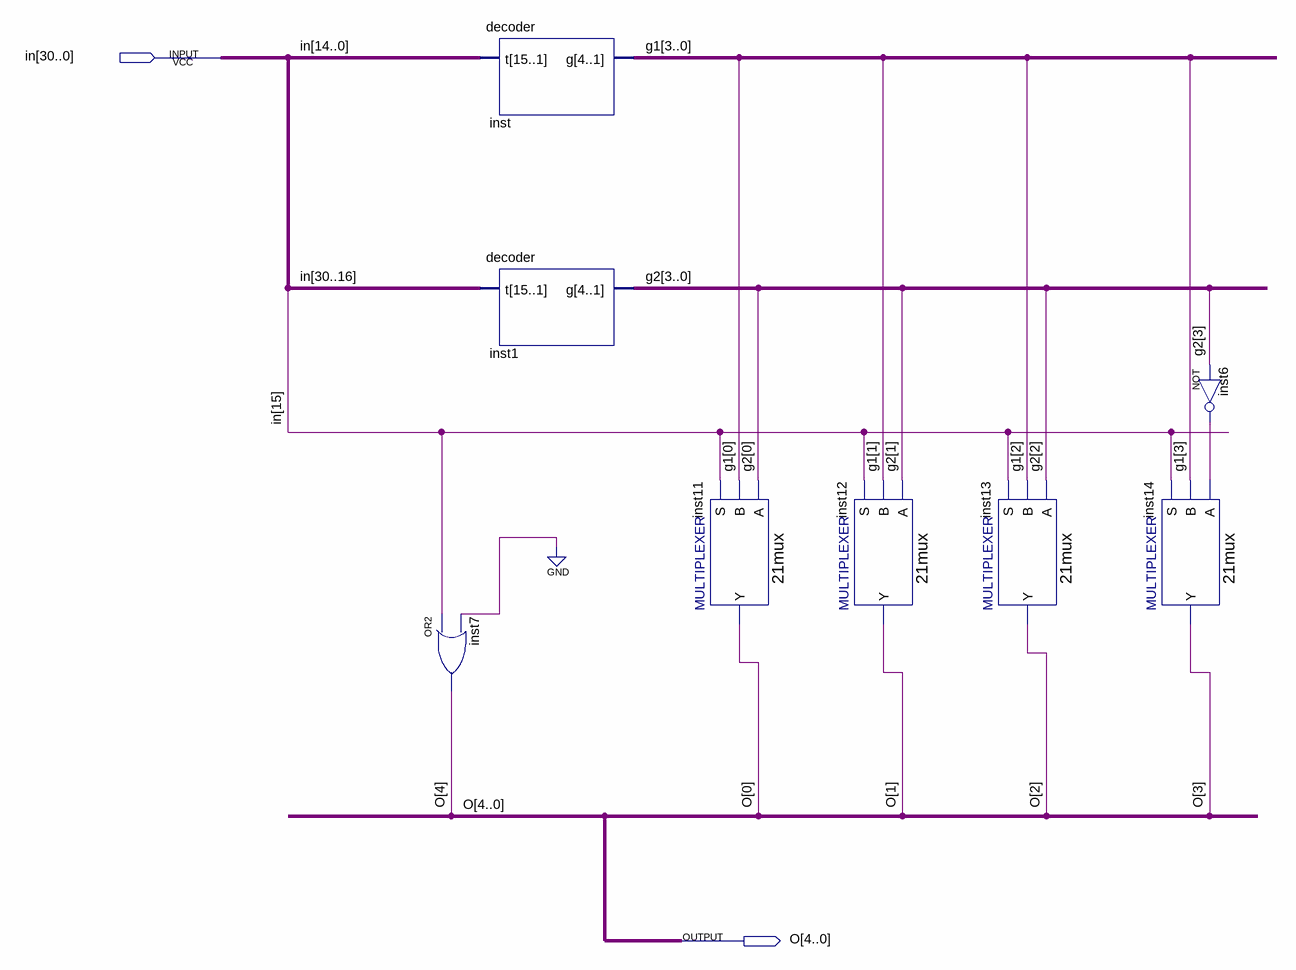
[diagram p0: schematic sheet]
// Quartus schematic decoder_5bit.bdf as structural Verilog: 8 symbols, 2 pins
module decoder_5bit (
  input  [30:0] in,
  output [4:0] O
);

  wire inst6_out;
  wire [3:0] g1, g2;

  or inst7 (O[4], in[15], 1'b0);
  decoder inst (.t(in[14:0]), .g(g1));
  decoder inst1 (.t(in[30:16]), .g(g2));
  \21mux  inst11 (.S(in[15]), .B(g1[0]), .A(g2[0]), .Y(O[0]));
  \21mux  inst12 (.S(in[15]), .B(g1[1]), .A(g2[1]), .Y(O[1]));
  \21mux  inst13 (.S(in[15]), .B(g1[2]), .A(g2[2]), .Y(O[2]));
  \21mux  inst14 (.S(in[15]), .B(g1[3]), .A(inst6_out), .Y(O[3]));
  not inst6 (inst6_out, g2[3]);
endmodule
